# EAGLE design LED_PD_Breadboard (EAGLE 9.7.0)
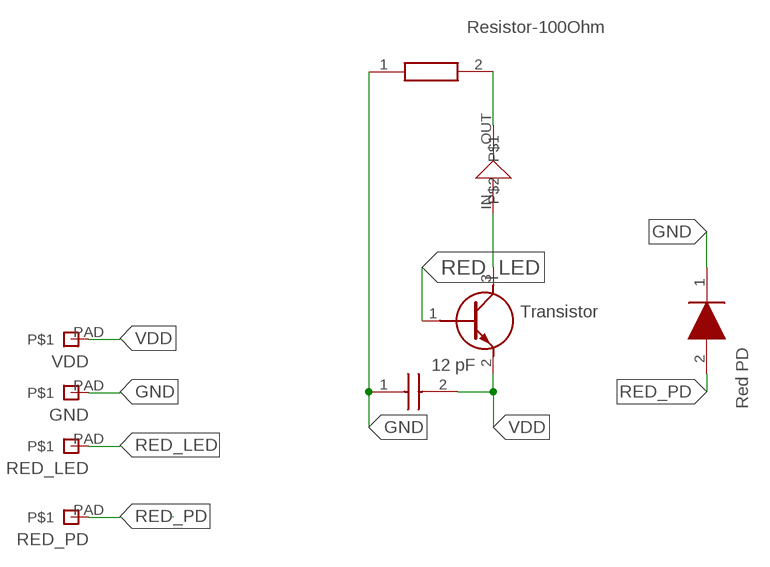
[diagram p0: schematic, sheet 1]

## Parts
C1  CAPACITOR-12PF  [CAPC1005X55N]
D1  REDPD  [SFH2713]
GND  PAD  [PAD]
Q1  TRANSISTOR  [SOT883B]
R1  RESISTOR-100OHM  [RESC1608X55N]
RED_LED  PAD  [PAD]
RED_PD  PAD  [PAD]
U$1  REDLED  [REDLED]
VDD  PAD  [PAD]

## Nets
GND: C1.1 D1.1(K) GND.PAD R1.1
N$7: Q1.3(C) U$1.IN
N$13: R1.2 U$1.OUT
RED_LED: Q1.1(B) RED_LED.PAD
RED_PD: D1.2(A) RED_PD.PAD
VDD: C1.2 Q1.2(E) VDD.PAD

## Library data of the parts
C1 = MABOS_Library:CAPACITOR-12PF: 12 pF; DESCRIPTION: Multilayer Ceramic Capacitors MLCC - SMD/SMT 12pF 2% 25V C0G; HEIGHT: 0.55mm; MANUFACTURER_NAME: Kemet; MANUFACTURER_PART_NUMBER: C0402C120G3GACTU; MOUSER_PART_NUMBER: 80-C0402C120G3G; MOUSER_PRICE-STOCK: https://www.mouser.com/Search/Refine.aspx?Keyword=80-C0402C120G3G
D1 = MABOS_Library:REDPD: Photodiodes Silicon PIN Photodiode Source: Datasheet <https://dammedia.osram.info/media/resource/hires/osram-dam-8960377/SFH 2713_EN.pdf>; DESCRIPTION: Photodiodes Silicon PIN Photodiode; HEIGHT: 0.7mm; MANUFACTURER_NAME: OSRAM; MANUFACTURER_PART_NUMBER: SFH 2713; MOUSER_PART_NUMBER: 720-SFH2713; MOUSER_PRICE-STOCK: https://www.mouser.co.uk/ProductDetail/OSRAM-Opto-Semiconductors/SFH-2713?qs=7MVldsJ5UayBhtoy5c4X7w%3D%3D
GND RED_LED RED_PD VDD = Nordic_BLE:PAD
Q1 = MABOS_Library:TRANSISTOR: Bipolar Transistors - BJT 45V NPN 100mA 250mW Source: Datasheet <https://componentsearchengine.com/Datasheets/1/BC847BMB,315.pdf>; DESCRIPTION: Bipolar Transistors - BJT 45V NPN 100mA 250mW; HEIGHT: mm; MANUFACTURER_NAME: Nexperia; MANUFACTURER_PART_NUMBER: BC847BMB,315; MOUSER_PART_NUMBER: 771-BC847BMB315; MOUSER_PRICE-STOCK: https://www.mouser.co.uk/ProductDetail/Nexperia/BC847BMB315?qs=5C9Q4QJFsuN7bUmIcU4LYw%3D%3D
R1 = MABOS_Library:RESISTOR-100OHM: Thick Film Resistors - SMD 100 OHM .1% 50PPM Source: Datasheet; DESCRIPTION: Thick Film Resistors - SMD 100 OHM .1% 50PPM; HEIGHT: 0.55mm; MANUFACTURER_NAME: KOA Speer; MANUFACTURER_PART_NUMBER: RS73G1JTTD1000B; MOUSER_PART_NUMBER: 660-RS73G1JTTD1000B; MOUSER_PRICE-STOCK: https://www.mouser.co.uk/ProductDetail/KOA-Speer/RS73G1JTTD1000B/?qs=GBLSl2AkiruQBcK7exZ%252Bcg%3D%3D
U$1 = MABOS_Library:REDLED

## Board
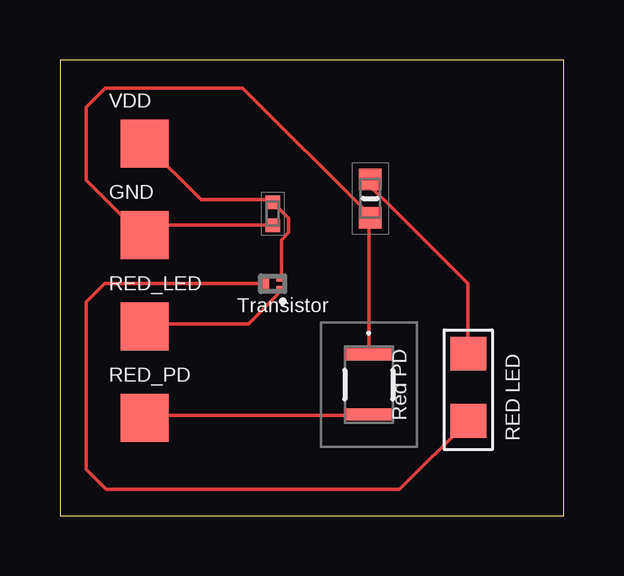
[diagram p1: board, top side]

Size 21 x 19 mm. Coordinates in mm from the lower left corner, seen from the top.
Outline: 0,0 21,0 21,19 0,19 0,0
Copper layers (1*16): Top / Bottom
Stack-up Default Layer Stack: Top User Defined 0.035mm / Dielectric-1 User Defined 1.5mm / Bottom User Defined 0.035mm
Design rules "default": minimum track width 6mil, minimum drill 0.35mm, track to track 6mil, track to pad 6mil, pad to pad 6mil, via to via 6mil, smd to smd 6mil, copper to edge 40mil, drill to drill 6mil, minimum pad ring 10mil, minimum via ring 8mil, stop-mask expansion 4mil, vias tented up to drill 0mil, thermal gap 10mil

### Footprints (pad centres in the part's own frame; a part is rotated, then mirrored left to right if it is on the bottom)
CAPC1005X55N = smd 0.56 x 0.62: 1 -0.48,1.27; 2 0.48,1.27
SFH2713 = smd 0.5 x 1.9: 1 -1.25,0; 2 1.25,0
PAD = smd 2 x 2: PAD 0,0
SOT883B = smd 0.4 x 0.25: 1 -0.35,0.225; 2 -0.35,-0.225 | smd 0.4 x 0.7: 3 0.35,0
RESC1608X55N = smd 0.9 x 0.95: 1 -0.8,0; 2 0.8,0
REDLED = smd 1.4 x 1.5: IN 2.8,0; OUT 0,0

### Placement (x,y rotation side)
C1  10.14,12.59 90 top
D1  12.88,5.46 270 top
GND  3.54,11.7 0 top
Q1  8.87,9.67 180 top
R1  12.94,13.22 90 top
RED_LED  3.54,7.89 0 top
RED_PD  3.54,4.08 0 top
U$1  17.02,6.75 270 top
VDD  3.54,15.51 0 top

### Tracks (layer width: path | path; a pad name or v marks a point on that pad's centre or on a via)
GND
  Top 0.152: 3.9,12.11 8.77,12.11 C1.1 | 3.9,12.11 3.59,11.8 GND.PAD 3.89,12.1 | D1.1 12.89,6.77 12.89,12.41 R1.1 12.89,12.56 7.62,17.83 1.89,17.83 1.09,17.03 1.09,14 2.99,12.1 3.89,12.1 | 3.9,12.11 3.89,12.1
N$7
  Top 0.152: Q1.3 3,9.67 2.98,9.67 1.85,9.67 1.09,8.91 1.09,1.92 1.92,1.09 14.16,1.09 U$1.IN 17,4.03
N$13
  Top 0.152: R1.2 13.04,13.94 13.04,13.63 13.84,12.84 17,9.67 17,6.77 U$1.OUT
RED_LED
  Top 0.152: Q1.1 9.08,9.36 9.08,9.21 7.86,7.99 3.59,7.99 RED_LED.PAD
RED_PD
  Top 0.152: D1.2 12.73,4.18 3.59,4.18 RED_PD.PAD
VDD
  Top 0.152: Q1.2 9.23,9.97 9.23,11.5 9.53,11.8 9.53,12.41 8.93,13.02 C1.2 8.77,13.17 5.88,13.17 VDD.PAD